# Altium project Chong's Cool STM32 Board.PrjPcb
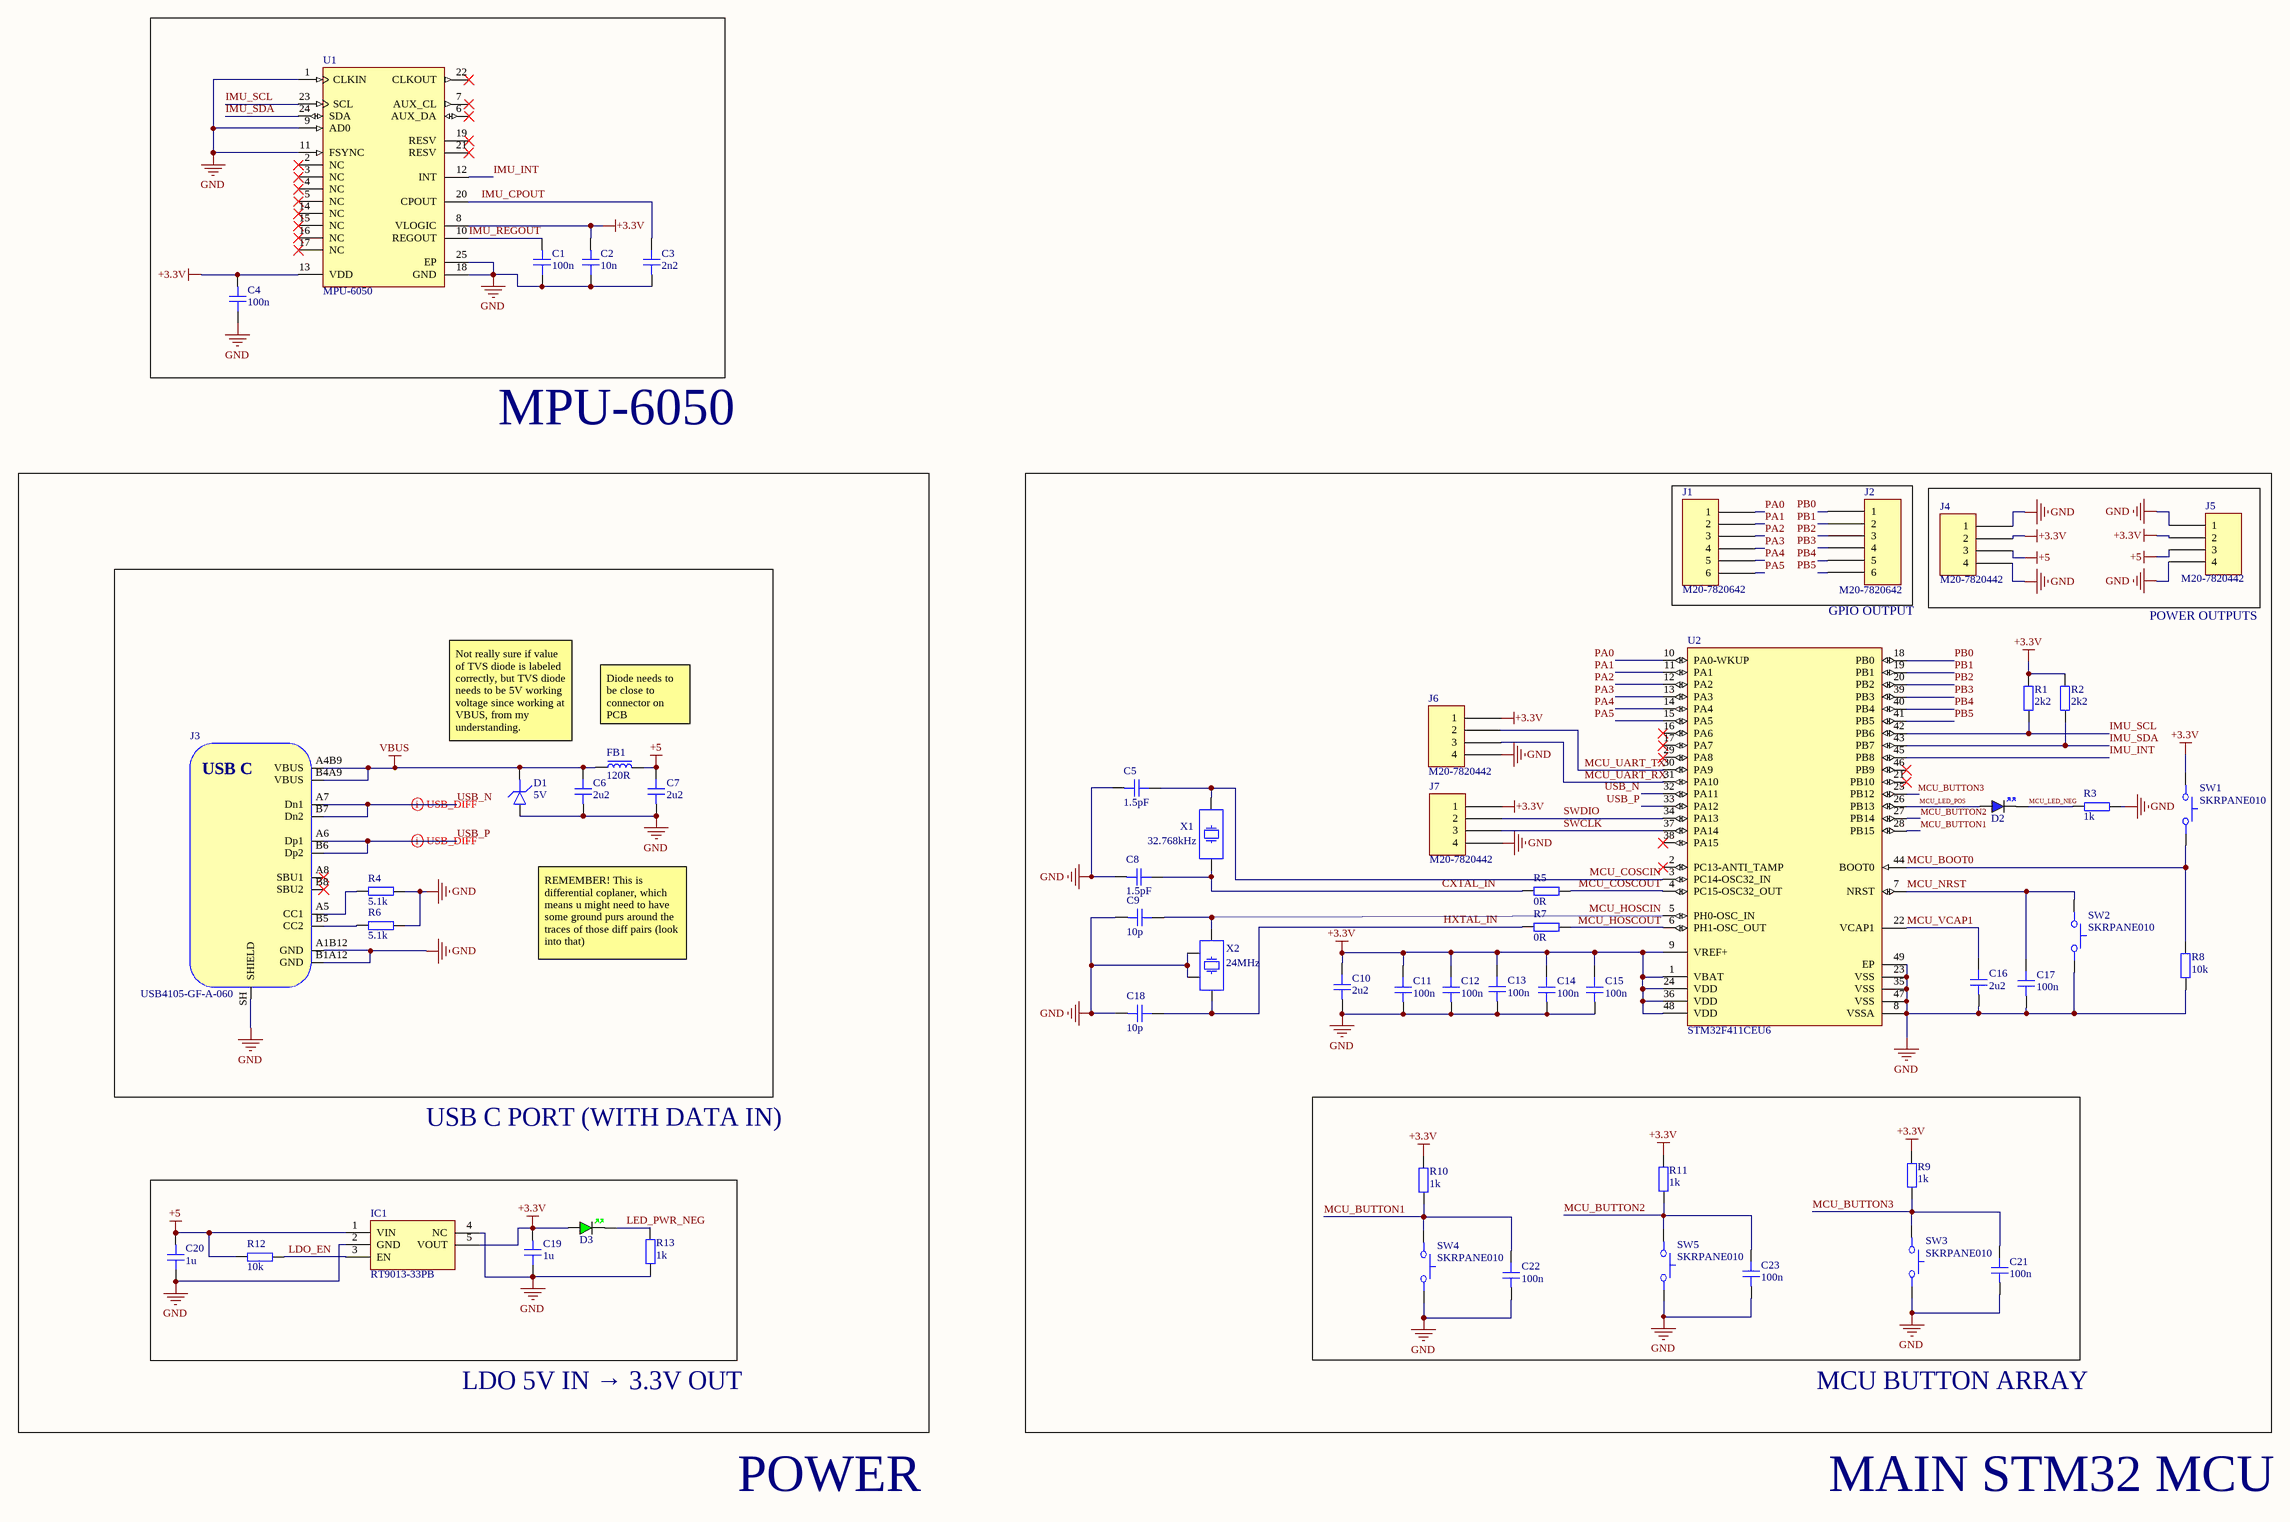
[diagram p0: Chong's Cool STM32 Board.SchDoc]
1 sheet, 57 parts. Net scope: global (net labels, ports and power ports of the same name join across sheets).
Board file: Chong's Cool STM32 Board.PcbDoc

## Sheet Chong's Cool STM32 Board.SchDoc
size A2; SheetNumber: 1; SheetTotal: 1

### Parts
C1  100n  [CAP_0402]
C2  10n  [CAP_0402]
C3  2n2  [CAP_0603]
C4  100n  [CAP_0402]
C5  1.5pF  [CAP_0402]
C6  2u2  [CAP_0603]
C7  2u2  [CAP_0603]
C8  1.5pF  [CAP_0402]
C9  10p  [CAP_0402]
C10  2u2  [CAP_0603]
C11  100n  [CAP_0402]
C12  100n  [CAP_0402]
C13  100n  [CAP_0402]
C14  100n  [CAP_0402]
C15  100n  [CAP_0402]
C16  2u2  [CAP_0603]
C17  100n  [CAP_0402]
C18  10p  [CAP_0402]
C19  1u  [CAP_0402]
C20  1u  [CAP_0402]
C21  100n  [CAP_0402]
C22  100n  [CAP_0402]
C23  100n  [CAP_0402]
D1  5V  [D_0402]
D2  BLUE  [LED_0402_BLUE]  (value not drawn)
D3  GREEN  [LED_0402_GREEN]  (value not drawn)
FB1  120R  [FB_0603]
IC1  RT9013-33PB  [SOT94P279X130-5N]
J1  M20-7820642  [HARWIN M20-7820645]
J2  M20-7820642  [HARWIN M20-7820645]
J3  USB4105-GF-A-060  [USB4105-GF-A-060]
J4  M20-7820442  [HARWIN M20-7820445]
J5  M20-7820442  [HARWIN M20-7820445]
J6  M20-7820442  [HARWIN M20-7820445]
J7  M20-7820442  [HARWIN M20-7820445]
R1  2k2  [RES_0402]
R2  2k2  [RES_0402]
R3  1k  [RES_0402]
R4  5.1k  [RES_0402]
R5  0R  [RES_0402]
R6  5.1k  [RES_0402]
R7  0R  [RES_0402]
R8  10k  [RES_0402]
R9  1k  [RES_0402]
R10  1k  [RES_0402]
R11  1k  [RES_0402]
R12  10k  [RES_0402]
R13  1k  [RES_0402]
SW1  SKRPANE010  [SKRPANE010]
SW2  SKRPANE010  [SKRPANE010]
SW3  SKRPANE010  [SKRPANE010]
SW4  SKRPANE010  [SKRPANE010]
SW5  SKRPANE010  [SKRPANE010]
U1  MPU-6050  [IS-QFN-24_V]
U2  STM32F411CEU6  [STM-UFQFPN48_L]
X1  32.768kHz  [XTAL_3215-2]
X2  24MHz  [XTAL_3225]

### Blocks framed on the sheet
MCU BUTTON ARRAY: C5 C8-C18 C21-C23 D2 J1 J2 J4-J7 R1-R3 R5 R7-R11 SW1-SW5 U2 X1 X2

### Nets
+3.3V: C2.1 C4.1 C10.2 C11.2 C12.2 C13.2 C14.2 C15.2 C19.1 D3.A IC1.5(VOUT) J4.2 J5.2 J6.1 J7.1 R1.2 R2.2 R9.2 R10.2 R11.2 SW1.12 U1.8(VLOGIC) U1.13(VDD) U2.1(VBAT) U2.9(VREF+) U2.24(VDD) U2.36(VDD) U2.48(VDD)
+5: C7.2 C20.1 FB1.2 IC1.1(VIN) J4.3 J5.3 R12.2
GND: C1.2 C2.2 C3.1 C4.2 C5.1 C6.1 C7.1 C8.1 C9.1 C10.1 C11.1 C12.1 C13.1 C14.1 C15.1 C16.1 C17.1 C18.1 C19.2 C20.2 C21.1 C22.1 C23.1 D1.A IC1.2(GND) IC1.4(NC) J3.A1B12(GND) J3.B1A12(GND) J3.SH(SHIELD) J4.1 J4.4 J5.1 J5.4 J6.4 J7.4 R3.1 R4.2 R6.2 R8.1 R13.1 SW2.34 SW3.34 SW4.34 SW5.34 U1.1(CLKIN) U1.9(AD0) U1.11(FSYNC) U1.18(GND) U1.25(EP) U2.8(VSSA) U2.23(VSS) U2.35(VSS) U2.47(VSS) U2.49(EP) X2.2 X2.4
VBUS: C6.2 D1.K FB1.1 J3.A4B9(VBUS) J3.B4A9(VBUS)
CXTAL_IN: C8.2 R5.2 X1.1
HXTAL_IN: C18.2 R7.2 X2.3
IMU_CPOUT: C3.2 U1.20(CPOUT)
IMU_INT: U1.12(INT) U2.45(PB8)
IMU_REGOUT: C1.1 U1.10(REGOUT)
IMU_SCL: R1.1 U1.23(SCL) U2.42(PB6)
IMU_SDA: R2.1 U1.24(SDA) U2.43(PB7)
LDO_EN: IC1.3(EN) R12.1
LED_PWR_NEG: D3.K R13.2
MCU_BOOT0: R8.2 SW1.34 U2.44(BOOT0)
MCU_BUTTON1: C22.2 R10.1 SW4.12 U2.28(PB15)
MCU_BUTTON2: C23.2 R11.1 SW5.12 U2.27(PB14)
MCU_BUTTON3: C21.2 R9.1 SW3.12 U2.25(PB12)
MCU_COSCIN: C5.2 U2.3(PC14-OSC32_IN) X1.2
MCU_COSCOUT: R5.1 U2.4(PC15-OSC32_OUT)
MCU_HOSCIN: C9.2 U2.5(PH0-OSC_IN) X2.1
MCU_HOSCOUT: R7.1 U2.6(PH1-OSC_OUT)
MCU_LED_NEG: D2.K R3.2
MCU_LED_POS: D2.A U2.26(PB13)
MCU_NRST: C17.2 SW2.12 U2.7(NRST)
MCU_UART_RX: J6.3 U2.31(PA10)
MCU_UART_TX: J6.2 U2.30(PA9)
MCU_VCAP1: C16.2 U2.22(VCAP1)
PA0: J1.1 U2.10(PA0-WKUP)
PA1: J1.2 U2.11(PA1)
PA2: J1.3 U2.12(PA2)
PA3: J1.4 U2.13(PA3)
PA4: J1.5 U2.14(PA4)
PA5: J1.6 U2.15(PA5)
PB0: J2.1 U2.18(PB0)
PB1: J2.2 U2.19(PB1)
PB2: J2.3 U2.20(PB2)
PB3: J2.4 U2.39(PB3)
PB4: J2.5 U2.40(PB4)
PB5: J2.6 U2.41(PB5)
SWCLK: J7.3 U2.37(PA14)
SWDIO: J7.2 U2.34(PA13)
USB_N: J3.A7(Dn1) J3.B7(Dn2) U2.32(PA11)
USB_P: J3.A6(Dp1) J3.B6(Dp2) U2.33(PA12)
NetJ3_A5: J3.A5(CC1) R4.1
NetJ3_B5: J3.B5(CC2) R6.1

Not connected (* = marked no-connect by the designer): J3 A8(SBU1)* B8(SBU2)*; U1 2(NC)* 3(NC)* 4(NC)* 5(NC)* 6(AUX_DA)* 7(AUX_CL)* 14(NC)* 15(NC)* 16(NC)* 17(NC)* 19(RESV)* 21(RESV)* 22(CLKOUT)*; U2 2(PC13-ANTI_TAMP)* 16(PA6)* 17(PA7)* 21(PB10)* 29(PA8)* 38(PA15)* 46(PB9)*

### Layout directives
differential pair; differential pair class USB_DIFF: USB_N, USB_P

### Notes on the sheet
- MPU-6050
- GPIO OUTPUT
- (near J5) POWER OUTPUTS
- Not really sure if value of TVS diode is labeled correctly, but TVS diode needs to be 5V working voltage since working at VBUS, from my understanding.
- Diode needs to be close to connector on PCB
- REMEMBER! This is differential coplaner, which means u might need to have some ground purs around the traces of those diff pairs (look into that)
- USB C PORT (WITH DATA IN)
- LDO 5V IN → 3.3V OUT
- POWER
- MAIN STM32 MCU
- (in symbol USB4105-GF-A-060) USB C

### Library data of the parts
C1 C2 C4 C5 C8 C9 C11-C15 C17-C23 = CAP_0402: Capacitor SMD 0402; Manufacturer: *; Manufacturer Part Number: *; Distributor Link: *; LCSC: *; Rating: *; Dielectric: *
C3 C6 C7 C10 C16 = CAP_0603: Capacitor SMD 0603; Manufacturer: *; Manufacturer Part Number: *; Distributor Link: *; LCSC: *; Rating: *; Dielectric: *
D1 = D_TVS_0402: Diode TVS / ESD 0402
D2 = LED_0402_BLUE: LED 0402 BLUE SMD
D3 = LED_0402_GREEN: LED 0402 GREEN SMD
FB1 = FB_0603: Ferrite Bead SMD 0603; Manufacturer: *; Manufacturer Part Number: *; Distributor Link: *; LCSC: *
IC1 = RT9013-12PB: Integrated Circuit, Get 33PB rather than 12PB; Manufacturer_Name: RICHTEK; Datasheet Link: https://www.digchip.com/datasheets/parts/datasheet/403/RT9013-12PB-pdf.php; Height: 1.295mm; Manufacturer_Part_Number: RT9013-12PB
J1 J2 = M20-7820642: CONN RCPT 6POS 0.1 GOLD PCB; Manufacturer: Harwin Inc.; Connector Type: Receptacle; Contact Length - Post: 0.118" (3.00mm); Current Rating (Amps): 3A; Mated Stacking Heights: 11.04mm, 12.63mm; Material Flammability Rating: UL94 V-0; Number of Positions: 6; Number of Positions Loaded: All; Pitch - Mating: 0.100" (2.54mm); Style: Board to Board or Cable; Part Number: M20-7820642; ComponentLink1Description: Datasheet; ComponentLink1URL: https://cdn.harwin.com/pdfs/C001XX_M20_Series_Connectors.pdf; ComponentLink2Description: DigiKey Link; ComponentLink2URL: https://www.digikey.com/en/products/detail/harwin-inc/M20-7820642/3727776; Contact Finish - Mating: Gold; Contact Finish - Post: Tin; Contact Finish Thickness - Mating: Flash; Contact Type: Female Socket; Fastening Type: Push-Pull; Insulation Color: Black; Insulation Height: 0.335" (8.51mm); LastUpdated: 21-Sep-22 6:58:09 PM; Lifecycle Status: Active; Minimum Order: 1; Mounting Type: Through Hole; Number of Rows: 1; Operating Temperature: -40°C ~ 105°C; Packaging: Tube; Part Status: Active; Price: 0.55; Series: M20; Supplier 1: DigiKey; Supplier Part Number 1: 952-1808-ND; Termination: Solder
J3 = USB4105-GF-A-060: USB Connector Type C SMT 12 Pin; Manufacturer: GCT; Manufacturer Part Number: USB4105-GF-A-060; Distributor Link: https://eu.mouser.com/ProductDetail/GCT/USB4105-GF-A-060?qs=QNEnbhJQKvY2mocwNJzgfA%3D%3D
J4-J7 = M20-7820442: CONN RCPT 4POS 0.1 GOLD PCB; Manufacturer: Harwin Inc.; Connector Type: Receptacle; Contact Length - Post: 0.118" (3.00mm); Current Rating (Amps): 3A; Mated Stacking Heights: 11.04mm, 12.63mm; Material Flammability Rating: UL94 V-0; Number of Positions: 4; Number of Positions Loaded: All; Pitch - Mating: 0.100" (2.54mm); Style: Board to Board or Cable; Part Number: M20-7820442; ComponentLink1Description: Datasheet; ComponentLink1URL: https://cdn.harwin.com/pdfs/Harwin_PC_Connectors_M20.pdf; ComponentLink2Description: DigiKey Link; ComponentLink2URL: https://www.digikey.com/en/products/detail/harwin-inc/M20-7820442/3727760; Contact Finish - Mating: Gold; Contact Finish - Post: Tin; Contact Finish Thickness - Mating: Flash; Contact Type: Female Socket; Fastening Type: Push-Pull; Insulation Color: Black; Insulation Height: 0.335" (8.51mm); LastUpdated: 21-Sep-22 6:57:11 PM; Lifecycle Status: Active; Minimum Order: 1; Mounting Type: Through Hole; Number of Rows: 1; Operating Temperature: -40°C ~ 105°C; Packaging: Tube; Part Status: Active; Price: 0.45; Series: M20; Supplier 1: DigiKey; Supplier Part Number 1: 952-1791-ND; Termination: Solder
R1-R13 = RES_0402: Resistor SMD 0402; Manufacturer: *; Manufacturer Part Number: *; Distributor Link: *; LCSC: *
SW1-SW5 = SKRPANE010: Tactile Switch SMD SPST; Manufacturer: Alps Alpine; Manufacturer Part Number: SKRPANE010
U1 = CMP-1753-00002-2: 3-Axis Gyroscope, Accelerometer and a Digital Motion Processor(TM) (DMP), 2.375 to 3.46 V, -40 to 85 degC, 24-Pin QFN, RoHS, Tape and Reel; Manufacturer: InvenSense; Featured Product: MPU-60506-Axis,IntegratedI²CSolution; Other Names: 1428-1007-2 / MPU6050; Sensor Type: MotionTracking; Online Catalog: MPU-6000™Series; Unit PriceUSD: Digital; Datasheet Version: Rev. 3.3, 05/2012; Category: Sensors,Transducers; Datasheet URL: http://datasheet.octopart.com/MPU-6050-InvenSense-datasheet-14421344.pdf; Family: Multifunction; Standard Package: 5,000; Manufacturer URL: http://www.invensense.com/; Output Type: Digital; Dynamic Catalog: MPU-6000™Series
U2 = CMP-0243-00165-1: ARM Cortex-M4 32-bit MCU+FPU, 512 KB Flash, 128 KB RAM, 36 I/Os, 48-Pin UFQFPN, -40 to 85 degC, Tray; Operating Frequency(F) (Processor speed) (MHz): 100; FLASH Size (Prog) (kB): 512; Internal RAM Size (kB): 128; I/Os (High Current): 36; Supply Voltage(Vcc) min (V): 1.7; Package Reference: 48-Pin Ultra Thin Fine Pitch Quad Flat No-Lead, 7 x 7 x 0.6 mm Body, 0.5 mm Pitch, Exposed Pad; ComponentLink1Description: Manufacturer URL; ComponentLink1URL: http://www.st.com/; Packing: Tray; Package Description: UFQFPN48; Core: ARM Cortex-M4; ComponentLink2Description: Datasheet; ComponentLink2URL: http://www.st.com/st-web-ui/static/active/en/resource/technical/document/datasheet/DM00115249.pdf; DatasheetVersion: Rev. 6; Mounting Technology: Surface Mount
X1 = XTAL_3215: Crystal SMD 3215; Distributor Link: *
X2 = TSX-3225_24.0000MF15X-AC: Crystal SMD 24MHz 10PPM 7pF 3225; Manufacturer: Epson; Manufacturer Part Number: TSX-3225 24.0000MF15X-AC